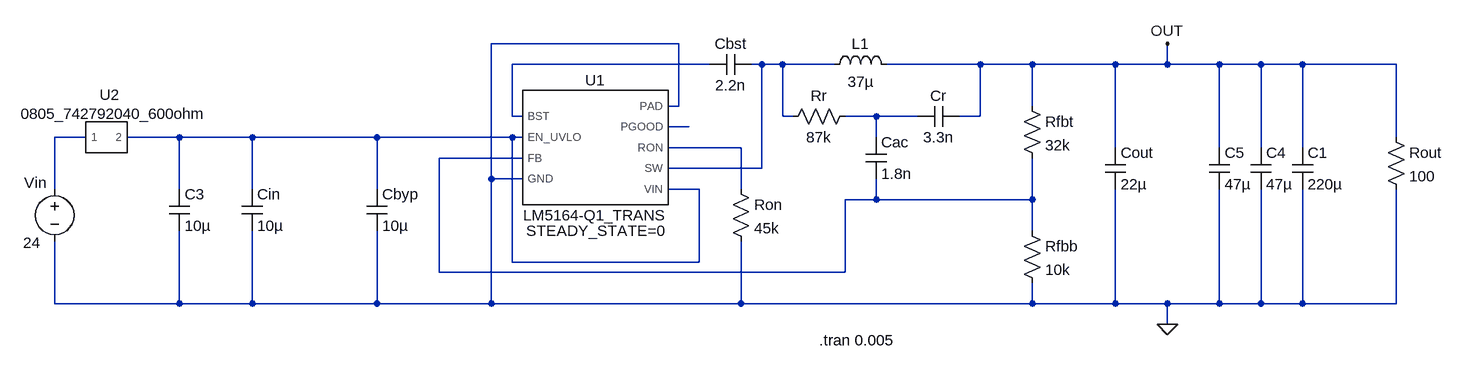
[diagram p0: schematic 24-V Input and 5-V Output using Buck Converter LM5164.asc]
24-V Input and 5-V Output using Buck Converter LM5164.asc, the LTspice schematic file:
Version 4
SHEET 1 1572 680
WIRE 352 -16 64 -16
WIRE 400 16 96 16
WIRE 480 16 464 16
WIRE 512 16 480 16
WIRE 592 16 512 16
WIRE 816 16 672 16
WIRE 896 16 816 16
WIRE 1024 16 896 16
WIRE 1104 16 1104 -16
WIRE 1104 16 1024 16
WIRE 1184 16 1104 16
WIRE 1248 16 1184 16
WIRE 1312 16 1248 16
WIRE 1456 16 1312 16
WIRE 352 80 352 -16
WIRE 352 80 336 80
WIRE 896 80 896 16
WIRE 96 96 96 16
WIRE 112 96 96 96
WIRE 512 96 512 16
WIRE 528 96 512 96
WIRE 656 96 608 96
WIRE 720 96 656 96
WIRE 816 96 816 16
WIRE 816 96 784 96
WIRE 368 112 336 112
WIRE -560 128 -608 128
WIRE -416 128 -496 128
WIRE -304 128 -416 128
WIRE -112 128 -304 128
WIRE 96 128 -112 128
WIRE 112 128 96 128
WIRE 656 128 656 96
WIRE 1456 128 1456 16
WIRE 448 144 336 144
WIRE 1024 144 1024 16
WIRE 1184 144 1184 16
WIRE 1248 144 1248 16
WIRE 1312 144 1312 16
WIRE 112 160 -16 160
WIRE 480 176 480 16
WIRE 480 176 336 176
WIRE 64 192 64 -16
WIRE 112 192 64 192
WIRE -608 208 -608 128
WIRE -416 208 -416 128
WIRE -304 208 -304 128
WIRE -112 208 -112 128
WIRE 384 208 336 208
WIRE 448 208 448 144
WIRE 656 224 656 192
WIRE 656 224 608 224
WIRE 896 224 896 160
WIRE 896 224 656 224
WIRE 896 272 896 224
WIRE 96 320 96 128
WIRE 384 320 384 208
WIRE 384 320 96 320
WIRE -16 336 -16 160
WIRE 608 336 608 224
WIRE 608 336 -16 336
WIRE -608 384 -608 288
WIRE -416 384 -416 272
WIRE -416 384 -608 384
WIRE -304 384 -304 272
WIRE -304 384 -416 384
WIRE -112 384 -112 272
WIRE -112 384 -304 384
WIRE 64 384 64 192
WIRE 64 384 -112 384
WIRE 448 384 448 288
WIRE 448 384 64 384
WIRE 896 384 896 352
WIRE 896 384 448 384
WIRE 1024 384 1024 208
WIRE 1024 384 896 384
WIRE 1104 384 1024 384
WIRE 1184 384 1184 208
WIRE 1184 384 1104 384
WIRE 1248 384 1248 208
WIRE 1248 384 1184 384
WIRE 1312 384 1312 208
WIRE 1312 384 1248 384
WIRE 1456 384 1456 208
WIRE 1456 384 1312 384
WIRE 1104 416 1104 384
FLAG 1104 416 0
FLAG 1104 -16 OUT
SYMBOL cap 464 0 R90
WINDOW 0 0 32 VBottom 2
WINDOW 3 32 32 VTop 2
SYMATTR InstName Cbst
SYMATTR Value 2.2n
SYMATTR SpiceLine Rser=1
SYMBOL ind 576 32 R270
WINDOW 0 32 56 VTop 2
WINDOW 3 5 56 VBottom 2
SYMATTR InstName L1
SYMATTR Value 37µ
SYMATTR SpiceLine Rser=5m
SYMBOL res 624 80 R90
WINDOW 0 0 56 VBottom 2
WINDOW 3 32 56 VTop 2
SYMATTR InstName Rr
SYMATTR Value 87k
SYMBOL cap 640 128 R0
SYMATTR InstName Cac
SYMATTR Value 1.8n
SYMATTR SpiceLine Rser=1m
SYMBOL cap 784 80 R90
WINDOW 0 0 32 VBottom 2
WINDOW 3 32 32 VTop 2
SYMATTR InstName Cr
SYMATTR Value 3.3n
SYMATTR SpiceLine Rser=785m
SYMBOL res 880 64 R0
SYMATTR InstName Rfbt
SYMATTR Value 32k
SYMBOL res 880 256 R0
SYMATTR InstName Rfbb
SYMATTR Value 10k
SYMBOL cap 1008 144 R0
SYMATTR InstName Cout
SYMATTR Value 22µ
SYMATTR SpiceLine Rser=3.6m
SYMBOL res 1440 112 R0
SYMATTR InstName Rout
SYMATTR Value 100
SYMBOL res 432 192 R0
SYMATTR InstName Ron
SYMATTR Value 45k
SYMBOL cap -128 208 R0
SYMATTR InstName Cbyp
SYMATTR Value 10µ
SYMBOL voltage -608 192 R0
WINDOW 123 0 0 Left 2
WINDOW 39 0 0 Left 2
WINDOW 0 -47 6 Left 2
WINDOW 3 -48 98 Left 2
SYMATTR InstName Vin
SYMATTR Value 24
SYMBOL cap -320 208 R0
SYMATTR InstName Cin
SYMATTR Value 10µ
SYMATTR SpiceLine Rser=5m
SYMBOL cap -432 208 R0
SYMATTR InstName C3
SYMATTR Value 10µ
SYMBOL cap 1296 144 R0
SYMATTR InstName C1
SYMATTR Value 220µ
SYMBOL cap 1232 144 R0
SYMATTR InstName C4
SYMATTR Value 47µ
SYMBOL cap 1168 144 R0
SYMATTR InstName C5
SYMATTR Value 47µ
SYMBOL 0805_742792040_600ohm -528 128 R0
WINDOW 0 5 -50 Bottom 2
WINDOW 3 13 -52 Top 2
SYMATTR InstName U2
SYMBOL LM5164-Q1_TRANS 224 144 R0
SYMATTR InstName U1
TEXT 568 440 Left 2 !.tran 0.005

The netlist it stands for:
* 24-V Input and 5-V Output using Buck Converter LM5164.asc
Cbst N002 N001 2.2n Rser=1
L1 N002 OUT 37µ Rser=5m
Rr N003 N002 87k
Cac N003 N008 1.8n Rser=1m
Cr OUT N003 3.3n Rser=785m
Rfbt OUT N008 32k
Rfbb N008 0 10k
Cout OUT 0 22µ Rser=3.6m
Rout OUT 0 100
Ron N007 0 45k
Cbyp N006 0 10µ
Vin N005 0 24
Cin N006 0 10µ Rser=5m
C3 N006 0 10µ
C1 OUT 0 220µ
C4 OUT 0 47µ
C5 OUT 0 47µ
XU2 N005 N006 0805_742792040_600ohm  ; pins 1 2
XU1 N001 N006 N008 0 0 N004 N007 N002 N006 LM5164-Q1_TRANS STEADY_STATE=0  ; pins BST EN_UVLO FB GND PAD PGOOD RON SW VIN
.tran 0.005
.lib C:\Users\simon\Downloads\742792040_LTSpice_WE-CBF_rev19a\WE-CBF_rev19a\WE-CBF.lib
.lib LM5164-Q1_TRANS.LIB
.backanno
.end